# Altium project 18650_Indicator.PrjPcb
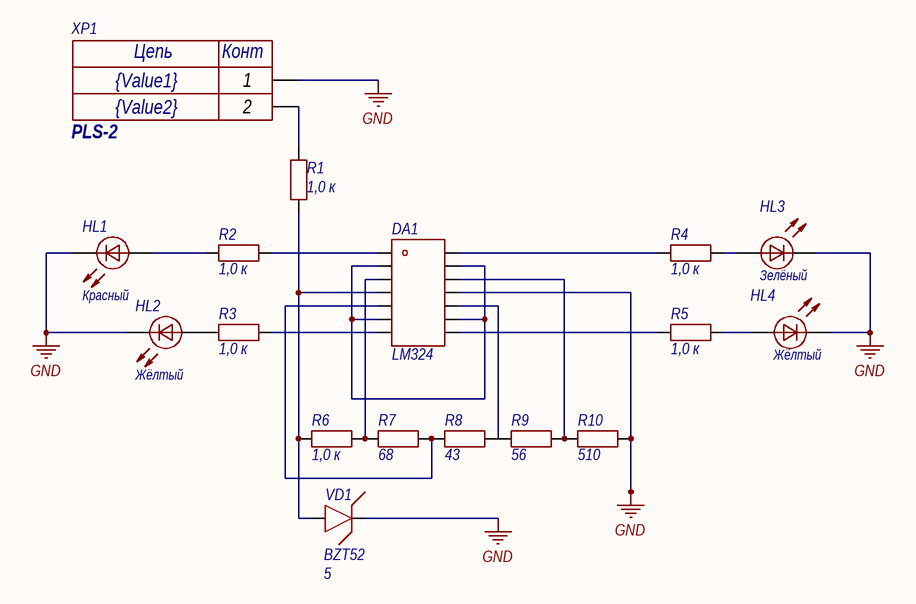
[diagram p0: Indicator_SH.SchDoc]
Decimal_Number_PCB: ГИДР.123456.002; Decimal_Number_Shematic: ГИДР.123456.001; DrawnBy: Базарин Т.; Release_Date: 13.05.2026; Title: Индикатор заряда; Version: 01
1 sheet, 17 parts. Net scope: global (net labels, ports and power ports of the same name join across sheets).
Board file: PCB_Indicator.PcbDoc

## Sheet Indicator_SH.SchDoc: Индикатор заряда
size 420 x 297 mm; SheetNumber: 1; SheetTotal: 1

### Parts
DA1  LM324  [SOIC-14]
HL1  value Красный  [0603D_red]  (hidden comment: LED 0603 RED)
HL2  value Жёлтый  [0603D_yellow]  (hidden comment: LED 0603 YELLOW)
HL3  value Зелёный  [0603D_green]  (hidden comment: LED 0603 GREEN)
HL4  value Жёлтый  [0603D_yellow]  (hidden comment: LED 0603 YELLOW)
R1  value 1,0 к  [0603R]  (hidden comment: Resistor)
R2  value 1,0 к  [0603R]  (hidden comment: Resistor)
R3  value 1,0 к  [0603R]  (hidden comment: Resistor)
R4  value 1,0 к  [0603R]  (hidden comment: Resistor)
R5  value 1,0 к  [0603R]  (hidden comment: Resistor)
R6  value 1,0 к  [0603R]  (hidden comment: Resistor)
R7  value 68  [0603R]  (hidden comment: Resistor)
R8  value 43  [0603R]  (hidden comment: Resistor)
R9  value 56  [0603R]  (hidden comment: Resistor)
R10  value 510  [0603R]  (hidden comment: Resistor)
VD1  BZT52  напряжение: 5  [SOD-323]
XP1  PLS-2  Value2: {Value2}  Value1: {Value1}  [PLS2]

### Nets
GND: DA1.11(GND) HL1.2 HL2.2 HL3.2 HL4.2 R10.2 VD1.2 XP1.1
NetDA1_1: DA1.1(OUT1) R2.2
NetDA1_2: DA1.2(IN1-) DA1.6(IN2-) DA1.9(IN3-) DA1.13(IN4-)
NetDA1_3: DA1.3(IN1+) R6.2 R7.1
NetDA1_4: DA1.4(VCC) R1.1 R6.1 VD1.1
NetDA1_5: DA1.5(IN2+) R7.2 R8.1
NetDA1_7: DA1.7(OUT2) R3.2
NetDA1_8: DA1.8(OUT3) R5.1
NetDA1_10: DA1.10(IN3+) R8.2 R9.1
NetDA1_12: DA1.12(IN4+) R9.2 R10.1
NetDA1_14: DA1.14(OUT4) R4.1
NetHL1_1: HL1.1 R2.1
NetHL2_1: HL2.1 R3.1
NetHL3_1: HL3.1 R4.2
NetHL4_1: HL4.1 R5.2
NetR1_2: R1.2 XP1.2

### Notes on the sheet
- Перв. примен.
- Справ. №
- Подп. и дата
- Инв. № дубл.
- Взам. инв. №
- Разраб.
- Изм.
- Лист
- № докум.
- Подп.
- Дата
- Лит.
- Масса
- Масштаб
- Пров.
- Т.контр.
- Схема электрическая принципиальная
- Листов
- Инв. № подл.
- Утв.
- Н.контр.
- Копировал
- Формат А3
- (in symbol PLS-2) Цепь; Конт

### Library data of the parts
HL1 = LED 0603 RED: Светодиод 0603 Красный; Автор: rreali; Part Number: LED 0603 RED
HL2 HL4 = LED 0603 YELLOW: Светодиод 0603 Жёлтый; Автор: rreali; Part Number: LED 0603 YELLOW
HL3 = LED 0603 GREEN: Светодиод 0603 Зелёный; Автор: rreali; Part Number: LED 0603 GREEN
R1-R6 = Resistor_1.0k_1_0603: Резистор номиналом 1,0 кОм 1%; Power: *; Part Number: Resistor_1.0k_1_0603; Tolerance: 1%
R7 = Resistor_68_1_0603: Резистор номиналом 68 Ом 1%; Power: *; Part Number: Resistor_68_1_0603; Tolerance: 1%
R8 = Resistor_43_1_0603: Резистор номиналом 43 Ом 1%; Power: *; Part Number: Resistor_43_1_0603; Tolerance: 1%
R9 = Resistor_56_1_0603: Резистор номиналом 56 Ом 1%; Power: *; Part Number: Resistor_56_1_0603; Tolerance: 1%
R10 = Resistor_510_1_0603: Резистор номиналом 510 Ом 1%; Power: *; Part Number: Resistor_510_1_0603; Tolerance: 1%
XP1 = PLS-2: Гребенка 2 пина; System: Connector; Автор: rreali; Part Number: PLS-2

## Assembly variants
01: all parts fitted